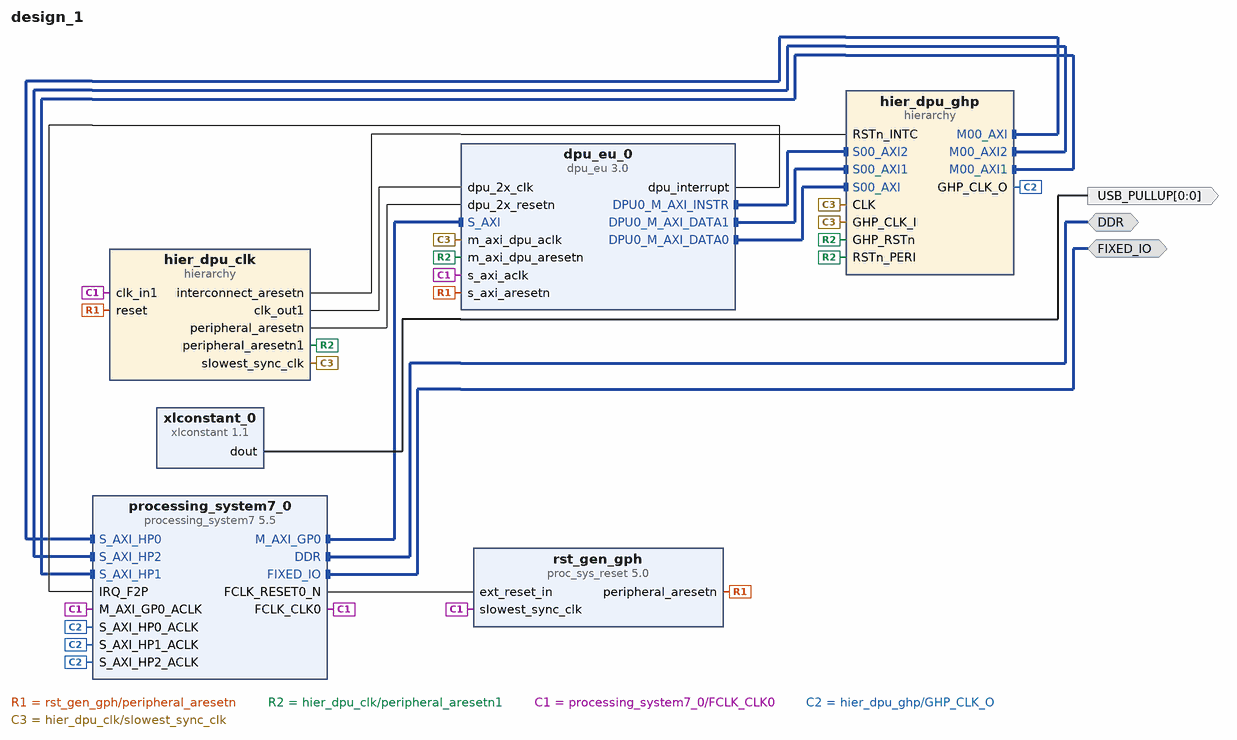
[diagram p0: block diagram of the top level]
# Vivado block design design_1, xc7z020clg484-1, Vivado 2019.2
create_bd_design design_1

create_bd_intf_port -mode Master -vlnv xilinx.com:interface:ddrx_rtl:1.0 DDR
create_bd_intf_port -mode Master -vlnv xilinx.com:display_processing_system7:fixedio_rtl:1.0 FIXED_IO
create_bd_port -dir O -from 0 -to 0 USB_PULLUP

create_bd_cell -type ip -vlnv xilinx.com:ip:processing_system7:5.5 processing_system7_0
set_property -dict [list \
  CONFIG.PCW_APU_PERIPHERAL_FREQMHZ 666.666666 \
  CONFIG.PCW_CAN_PERIPHERAL_FREQMHZ 23.8095 \
  CONFIG.PCW_ENET0_ENET0_IO {MIO 16 .. 27} \
  CONFIG.PCW_ENET0_GRP_MDIO_ENABLE 0 \
  CONFIG.PCW_ENET0_PERIPHERAL_ENABLE 1 \
  CONFIG.PCW_ENET0_RESET_ENABLE 1 \
  CONFIG.PCW_ENET0_RESET_IO {MIO 11} \
  CONFIG.PCW_ENET_RESET_ENABLE 1 \
  CONFIG.PCW_ENET_RESET_SELECT {Share reset pin} \
  CONFIG.PCW_FPGA0_PERIPHERAL_FREQMHZ 100 \
  CONFIG.PCW_GPIO_MIO_GPIO_ENABLE 1 \
  CONFIG.PCW_GPIO_MIO_GPIO_IO MIO \
  CONFIG.PCW_I2C0_RESET_ENABLE 1 \
  CONFIG.PCW_I2C0_RESET_IO {MIO 13} \
  CONFIG.PCW_I2C_RESET_ENABLE 1 \
  CONFIG.PCW_IRQ_F2P_INTR 1 \
  CONFIG.PCW_PRESET_BANK0_VOLTAGE {LVCMOS 1.8V} \
  CONFIG.PCW_PRESET_BANK1_VOLTAGE {LVCMOS 1.8V} \
  CONFIG.PCW_QSPI_GRP_SINGLE_SS_ENABLE 1 \
  CONFIG.PCW_QSPI_GRP_SINGLE_SS_IO {MIO 1 .. 6} \
  CONFIG.PCW_QSPI_PERIPHERAL_ENABLE 1 \
  CONFIG.PCW_QSPI_QSPI_IO {MIO 1 .. 6} \
  CONFIG.PCW_SD0_GRP_CD_ENABLE 1 \
  CONFIG.PCW_SD0_GRP_CD_IO {MIO 0} \
  CONFIG.PCW_SD0_GRP_WP_ENABLE 1 \
  CONFIG.PCW_SD0_GRP_WP_IO {MIO 15} \
  CONFIG.PCW_SD0_PERIPHERAL_ENABLE 1 \
  CONFIG.PCW_SD0_SD0_IO {MIO 40 .. 45} \
  CONFIG.PCW_SDIO_PERIPHERAL_FREQMHZ 50 \
  CONFIG.PCW_SINGLE_QSPI_DATA_MODE x4 \
  CONFIG.PCW_TTC0_PERIPHERAL_ENABLE 1 \
  CONFIG.PCW_TTC0_TTC0_IO EMIO \
  CONFIG.PCW_UART1_PERIPHERAL_ENABLE 1 \
  CONFIG.PCW_UART1_UART1_IO {MIO 48 .. 49} \
  CONFIG.PCW_UART_PERIPHERAL_FREQMHZ 50 \
  CONFIG.PCW_UIPARAM_DDR_FREQ_MHZ 533.333333 \
  CONFIG.PCW_UIPARAM_DDR_PARTNO {MT41J128M16 HA-15E} \
  CONFIG.PCW_UIPARAM_GENERATE_SUMMARY NONE \
  CONFIG.PCW_USB0_PERIPHERAL_ENABLE 1 \
  CONFIG.PCW_USB0_RESET_ENABLE 1 \
  CONFIG.PCW_USB0_RESET_IO {MIO 7} \
  CONFIG.PCW_USB0_USB0_IO {MIO 28 .. 39} \
  CONFIG.PCW_USB_RESET_ENABLE 1 \
  CONFIG.PCW_USB_RESET_SELECT {Share reset pin} \
  CONFIG.PCW_USE_FABRIC_INTERRUPT 1 \
  CONFIG.PCW_USE_S_AXI_HP0 1 \
  CONFIG.PCW_USE_S_AXI_HP1 1 \
  CONFIG.PCW_USE_S_AXI_HP2 1 \
  CONFIG.preset ZC702 \
] [get_bd_cells processing_system7_0]
# 231 more settings of processing_system7_0 are not shown: defaults, MIO pin electricals, DDR timing, and values the tool derives
create_bd_cell -type ip -vlnv xilinx.com:ip:proc_sys_reset:5.0 rst_gen_gph
set_property -dict {CONFIG.C_AUX_RST_WIDTH 4} [get_bd_cells rst_gen_gph]
create_bd_cell -type ip -vlnv xilinx.com:ip:xlconstant:1.1 xlconstant_0
create_bd_cell -type hier hier_dpu_clk
create_bd_cell -type hier hier_dpu_ghp
create_bd_cell -type ip -vlnv xilinx.com:ip:dpu_eu:3.0 dpu_eu_0
set_property -dict [list \
  CONFIG.ARCH 1152 \
  CONFIG.TIME_DAY 22 \
  CONFIG.TIME_HOUR 9 \
  CONFIG.TIME_MONTH 6 \
  CONFIG.TIME_QUARTER 3 \
  CONFIG.TIME_YEAR 20 \
] [get_bd_cells dpu_eu_0]

# ---- hierarchy /hier_dpu_clk ----
current_bd_instance /hier_dpu_clk
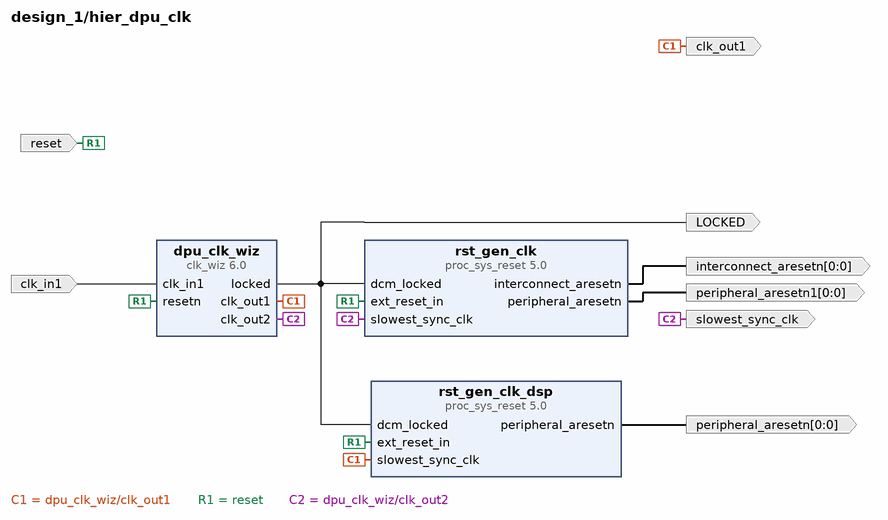
[diagram p1: block diagram inside /hier_dpu_clk]
create_bd_pin -dir O -type clk clk_out1
create_bd_pin -dir I -type rst reset
create_bd_pin -dir O -from 0 -to 0 -type rst peripheral_aresetn
create_bd_pin -dir I -type clk clk_in1
create_bd_pin -dir O -type clk slowest_sync_clk
create_bd_pin -dir O -from 0 -to 0 -type rst interconnect_aresetn
create_bd_pin -dir O -from 0 -to 0 -type rst peripheral_aresetn1
create_bd_pin -dir O LOCKED

create_bd_cell -type ip -vlnv xilinx.com:ip:proc_sys_reset:5.0 rst_gen_clk_dsp
create_bd_cell -type ip -vlnv xilinx.com:ip:clk_wiz:6.0 dpu_clk_wiz
set_property -dict [list \
  CONFIG.CLKOUT1_JITTER 224.262 \
  CONFIG.CLKOUT1_PHASE_ERROR 296.868 \
  CONFIG.CLKOUT1_REQUESTED_OUT_FREQ 180 \
  CONFIG.CLKOUT2_JITTER 247.412 \
  CONFIG.CLKOUT2_PHASE_ERROR 296.868 \
  CONFIG.CLKOUT2_REQUESTED_OUT_FREQ 90 \
  CONFIG.CLKOUT2_USED true \
  CONFIG.ENABLE_CLOCK_MONITOR false \
  CONFIG.MMCM_CLKFBOUT_MULT_F 49.500 \
  CONFIG.MMCM_CLKOUT0_DIVIDE_F 5.500 \
  CONFIG.MMCM_CLKOUT1_DIVIDE 11 \
  CONFIG.NUM_OUT_CLKS 2 \
  CONFIG.PRIMITIVE MMCM \
  CONFIG.RESET_PORT resetn \
  CONFIG.RESET_TYPE ACTIVE_LOW \
] [get_bd_cells dpu_clk_wiz]
create_bd_cell -type ip -vlnv xilinx.com:ip:proc_sys_reset:5.0 rst_gen_clk

# ---- hierarchy /hier_dpu_ghp ----
current_bd_instance /hier_dpu_ghp
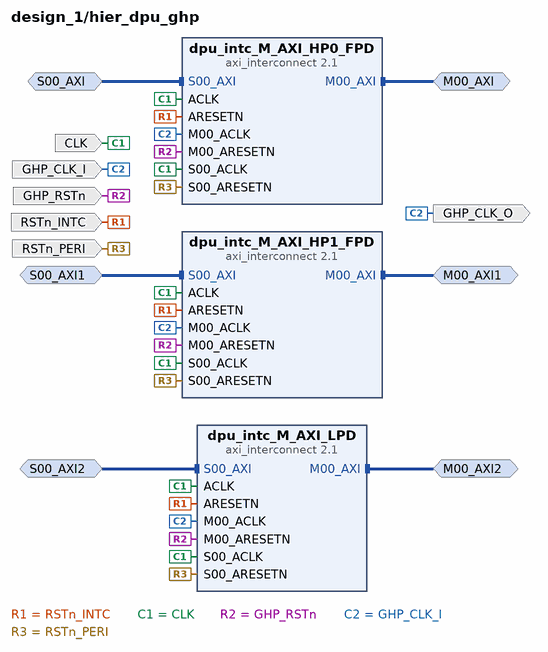
[diagram p2: block diagram inside /hier_dpu_ghp]
create_bd_intf_pin -mode Slave -vlnv xilinx.com:interface:aximm_rtl:1.0 S00_AXI
create_bd_intf_pin -mode Master -vlnv xilinx.com:interface:aximm_rtl:1.0 M00_AXI
create_bd_intf_pin -mode Slave -vlnv xilinx.com:interface:aximm_rtl:1.0 S00_AXI1
create_bd_intf_pin -mode Master -vlnv xilinx.com:interface:aximm_rtl:1.0 M00_AXI1
create_bd_intf_pin -mode Slave -vlnv xilinx.com:interface:aximm_rtl:1.0 S00_AXI2
create_bd_intf_pin -mode Master -vlnv xilinx.com:interface:aximm_rtl:1.0 M00_AXI2
create_bd_pin -dir I -type clk CLK
create_bd_pin -dir I -type rst RSTn_INTC
create_bd_pin -dir I -type rst GHP_RSTn
create_bd_pin -dir I -type clk GHP_CLK_I
create_bd_pin -dir I RSTn_PERI
create_bd_pin -dir O GHP_CLK_O

create_bd_cell -type ip -vlnv xilinx.com:ip:axi_interconnect:2.1 dpu_intc_M_AXI_HP0_FPD
set_property -dict [list \
  CONFIG.ENABLE_ADVANCED_OPTIONS 0 \
  CONFIG.M00_SECURE 0 \
  CONFIG.NUM_MI 1 \
  CONFIG.NUM_SI 1 \
] [get_bd_cells dpu_intc_M_AXI_HP0_FPD]
create_bd_cell -type ip -vlnv xilinx.com:ip:axi_interconnect:2.1 dpu_intc_M_AXI_HP1_FPD
set_property -dict {CONFIG.NUM_MI 1 CONFIG.NUM_SI 1} [get_bd_cells dpu_intc_M_AXI_HP1_FPD]
create_bd_cell -type ip -vlnv xilinx.com:ip:axi_interconnect:2.1 dpu_intc_M_AXI_LPD
set_property -dict {CONFIG.NUM_MI 1} [get_bd_cells dpu_intc_M_AXI_LPD]

# ---- connections ----

current_bd_instance /hier_dpu_clk
connect_bd_net -net clk_wiz_0_locked [get_bd_pins dpu_clk_wiz/locked] \
  [get_bd_pins rst_gen_clk_dsp/dcm_locked] [get_bd_pins rst_gen_clk/dcm_locked] [get_bd_pins LOCKED]
connect_bd_net -net clk_wiz_0_clk_out1 [get_bd_pins dpu_clk_wiz/clk_out1] [get_bd_pins clk_out1] [get_bd_pins rst_gen_clk_dsp/slowest_sync_clk]
connect_bd_net -net rst_ps7_0_50M_peripheral_aresetn [get_bd_pins reset] \
  [get_bd_pins rst_gen_clk/ext_reset_in] [get_bd_pins rst_gen_clk_dsp/ext_reset_in] [get_bd_pins dpu_clk_wiz/resetn]
connect_bd_net -net rst_ps7_0_50M1_peripheral_aresetn [get_bd_pins rst_gen_clk_dsp/peripheral_aresetn] [get_bd_pins peripheral_aresetn]
connect_bd_net [get_bd_pins clk_in1] [get_bd_pins dpu_clk_wiz/clk_in1]
connect_bd_net -net clk_wiz_0_clk_out2 [get_bd_pins dpu_clk_wiz/clk_out2] [get_bd_pins slowest_sync_clk] [get_bd_pins rst_gen_clk/slowest_sync_clk]
connect_bd_net -net rst_ps7_0_50M2_interconnect_aresetn [get_bd_pins rst_gen_clk/interconnect_aresetn] [get_bd_pins interconnect_aresetn]
connect_bd_net -net rst_ps7_0_50M2_peripheral_aresetn [get_bd_pins rst_gen_clk/peripheral_aresetn] [get_bd_pins peripheral_aresetn1]

current_bd_instance /hier_dpu_ghp
connect_bd_intf_net -intf_net axi_mem_intercon1_M00_AXI [get_bd_intf_pins M00_AXI] [get_bd_intf_pins dpu_intc_M_AXI_HP0_FPD/M00_AXI]
connect_bd_intf_net -intf_net dpu_eu_0_DPU0_M_AXI_DATA0 [get_bd_intf_pins S00_AXI1] [get_bd_intf_pins dpu_intc_M_AXI_HP1_FPD/S00_AXI]
connect_bd_intf_net [get_bd_intf_pins S00_AXI2] [get_bd_intf_pins dpu_intc_M_AXI_LPD/S00_AXI]
connect_bd_intf_net [get_bd_intf_pins S00_AXI] [get_bd_intf_pins dpu_intc_M_AXI_HP0_FPD/S00_AXI]
connect_bd_intf_net -intf_net axi_mem_intercon_M00_AXI [get_bd_intf_pins M00_AXI1] [get_bd_intf_pins dpu_intc_M_AXI_HP1_FPD/M00_AXI]
connect_bd_intf_net [get_bd_intf_pins M00_AXI2] [get_bd_intf_pins dpu_intc_M_AXI_LPD/M00_AXI]
connect_bd_net -net rst_ps7_0_50M2_interconnect_aresetn [get_bd_pins RSTn_INTC] \
  [get_bd_pins dpu_intc_M_AXI_LPD/ARESETN] [get_bd_pins dpu_intc_M_AXI_HP1_FPD/ARESETN] \
  [get_bd_pins dpu_intc_M_AXI_HP0_FPD/ARESETN]
connect_bd_net [get_bd_pins CLK] \
  [get_bd_pins dpu_intc_M_AXI_LPD/ACLK] [get_bd_pins dpu_intc_M_AXI_LPD/S00_ACLK] [get_bd_pins dpu_intc_M_AXI_HP1_FPD/ACLK] \
  [get_bd_pins dpu_intc_M_AXI_HP1_FPD/S00_ACLK] [get_bd_pins dpu_intc_M_AXI_HP0_FPD/ACLK] \
  [get_bd_pins dpu_intc_M_AXI_HP0_FPD/S00_ACLK]
connect_bd_net -net M00_ARESETN_1 [get_bd_pins GHP_RSTn] \
  [get_bd_pins dpu_intc_M_AXI_LPD/M00_ARESETN] [get_bd_pins dpu_intc_M_AXI_HP1_FPD/M00_ARESETN] \
  [get_bd_pins dpu_intc_M_AXI_HP0_FPD/M00_ARESETN]
connect_bd_net -net M00_ACLK_1 [get_bd_pins GHP_CLK_I] \
  [get_bd_pins dpu_intc_M_AXI_LPD/M00_ACLK] [get_bd_pins dpu_intc_M_AXI_HP1_FPD/M00_ACLK] \
  [get_bd_pins dpu_intc_M_AXI_HP0_FPD/M00_ACLK] [get_bd_pins GHP_CLK_O]
connect_bd_net -net S00_ARESETN_1 [get_bd_pins RSTn_PERI] \
  [get_bd_pins dpu_intc_M_AXI_LPD/S00_ARESETN] [get_bd_pins dpu_intc_M_AXI_HP1_FPD/S00_ARESETN] \
  [get_bd_pins dpu_intc_M_AXI_HP0_FPD/S00_ARESETN]

current_bd_instance /
connect_bd_intf_net [get_bd_intf_pins dpu_eu_0/S_AXI] [get_bd_intf_pins processing_system7_0/M_AXI_GP0]
connect_bd_intf_net [get_bd_intf_pins dpu_eu_0/DPU0_M_AXI_INSTR] [get_bd_intf_pins hier_dpu_ghp/S00_AXI2]
connect_bd_intf_net [get_bd_intf_pins dpu_eu_0/DPU0_M_AXI_DATA1] [get_bd_intf_pins hier_dpu_ghp/S00_AXI1]
connect_bd_intf_net [get_bd_intf_pins processing_system7_0/S_AXI_HP0] [get_bd_intf_pins hier_dpu_ghp/M00_AXI]
connect_bd_intf_net [get_bd_intf_ports DDR] [get_bd_intf_pins processing_system7_0/DDR]
connect_bd_intf_net [get_bd_intf_pins hier_dpu_ghp/M00_AXI2] [get_bd_intf_pins processing_system7_0/S_AXI_HP2]
connect_bd_intf_net [get_bd_intf_pins hier_dpu_ghp/M00_AXI1] [get_bd_intf_pins processing_system7_0/S_AXI_HP1]
connect_bd_intf_net [get_bd_intf_ports FIXED_IO] [get_bd_intf_pins processing_system7_0/FIXED_IO]
connect_bd_intf_net [get_bd_intf_pins dpu_eu_0/DPU0_M_AXI_DATA0] [get_bd_intf_pins hier_dpu_ghp/S00_AXI]
connect_bd_net [get_bd_pins processing_system7_0/FCLK_RESET0_N] [get_bd_pins rst_gen_gph/ext_reset_in]
connect_bd_net -net rst_ps7_0_50M_peripheral_aresetn [get_bd_pins rst_gen_gph/peripheral_aresetn] \
  [get_bd_pins hier_dpu_clk/reset] [get_bd_pins dpu_eu_0/s_axi_aresetn]
connect_bd_net -net rst_ps7_0_50M2_interconnect_aresetn [get_bd_pins hier_dpu_clk/interconnect_aresetn] [get_bd_pins hier_dpu_ghp/RSTn_INTC]
connect_bd_net -net rst_ps7_0_50M2_peripheral_aresetn [get_bd_pins hier_dpu_clk/peripheral_aresetn1] \
  [get_bd_pins hier_dpu_ghp/GHP_RSTn] [get_bd_pins hier_dpu_ghp/RSTn_PERI] [get_bd_pins dpu_eu_0/m_axi_dpu_aresetn]
connect_bd_net [get_bd_pins processing_system7_0/FCLK_CLK0] \
  [get_bd_pins processing_system7_0/M_AXI_GP0_ACLK] [get_bd_pins rst_gen_gph/slowest_sync_clk] \
  [get_bd_pins hier_dpu_clk/clk_in1] [get_bd_pins dpu_eu_0/s_axi_aclk]
connect_bd_net [get_bd_pins hier_dpu_ghp/GHP_CLK_O] \
  [get_bd_pins processing_system7_0/S_AXI_HP0_ACLK] [get_bd_pins processing_system7_0/S_AXI_HP2_ACLK] \
  [get_bd_pins processing_system7_0/S_AXI_HP1_ACLK]
connect_bd_net [get_bd_pins hier_dpu_clk/slowest_sync_clk] \
  [get_bd_pins hier_dpu_ghp/GHP_CLK_I] [get_bd_pins hier_dpu_ghp/CLK] [get_bd_pins dpu_eu_0/m_axi_dpu_aclk]
connect_bd_net [get_bd_pins xlconstant_0/dout] [get_bd_ports USB_PULLUP]
connect_bd_net [get_bd_pins dpu_eu_0/dpu_interrupt] [get_bd_pins processing_system7_0/IRQ_F2P]
connect_bd_net [get_bd_pins hier_dpu_clk/clk_out1] [get_bd_pins dpu_eu_0/dpu_2x_clk]
connect_bd_net [get_bd_pins hier_dpu_clk/peripheral_aresetn] [get_bd_pins dpu_eu_0/dpu_2x_resetn]

# ---- address map ----
assign_bd_address -offset 0x0000000000 -range 512M -target_address_space [get_bd_addr_spaces dpu_eu_0/DPU0_M_AXI_DATA0] [get_bd_addr_segs processing_system7_0/S_AXI_HP0/HP0_DDR_LOWOCM]
assign_bd_address -offset 0x0000000000 -range 512M -target_address_space [get_bd_addr_spaces dpu_eu_0/DPU0_M_AXI_DATA1] [get_bd_addr_segs processing_system7_0/S_AXI_HP1/HP1_DDR_LOWOCM]
assign_bd_address -offset 0x0000000000 -range 512M -target_address_space [get_bd_addr_spaces dpu_eu_0/DPU0_M_AXI_INSTR] [get_bd_addr_segs processing_system7_0/S_AXI_HP2/HP2_DDR_LOWOCM]
assign_bd_address -offset 0x40000000 -range 16M -target_address_space [get_bd_addr_spaces processing_system7_0/Data] [get_bd_addr_segs dpu_eu_0/S_AXI/reg0]

validate_bd_design
save_bd_design
